# Altium schematic sheet Mini Multi Function Device.SchDoc
size A3; SheetNumber: 1; SheetTotal: 1
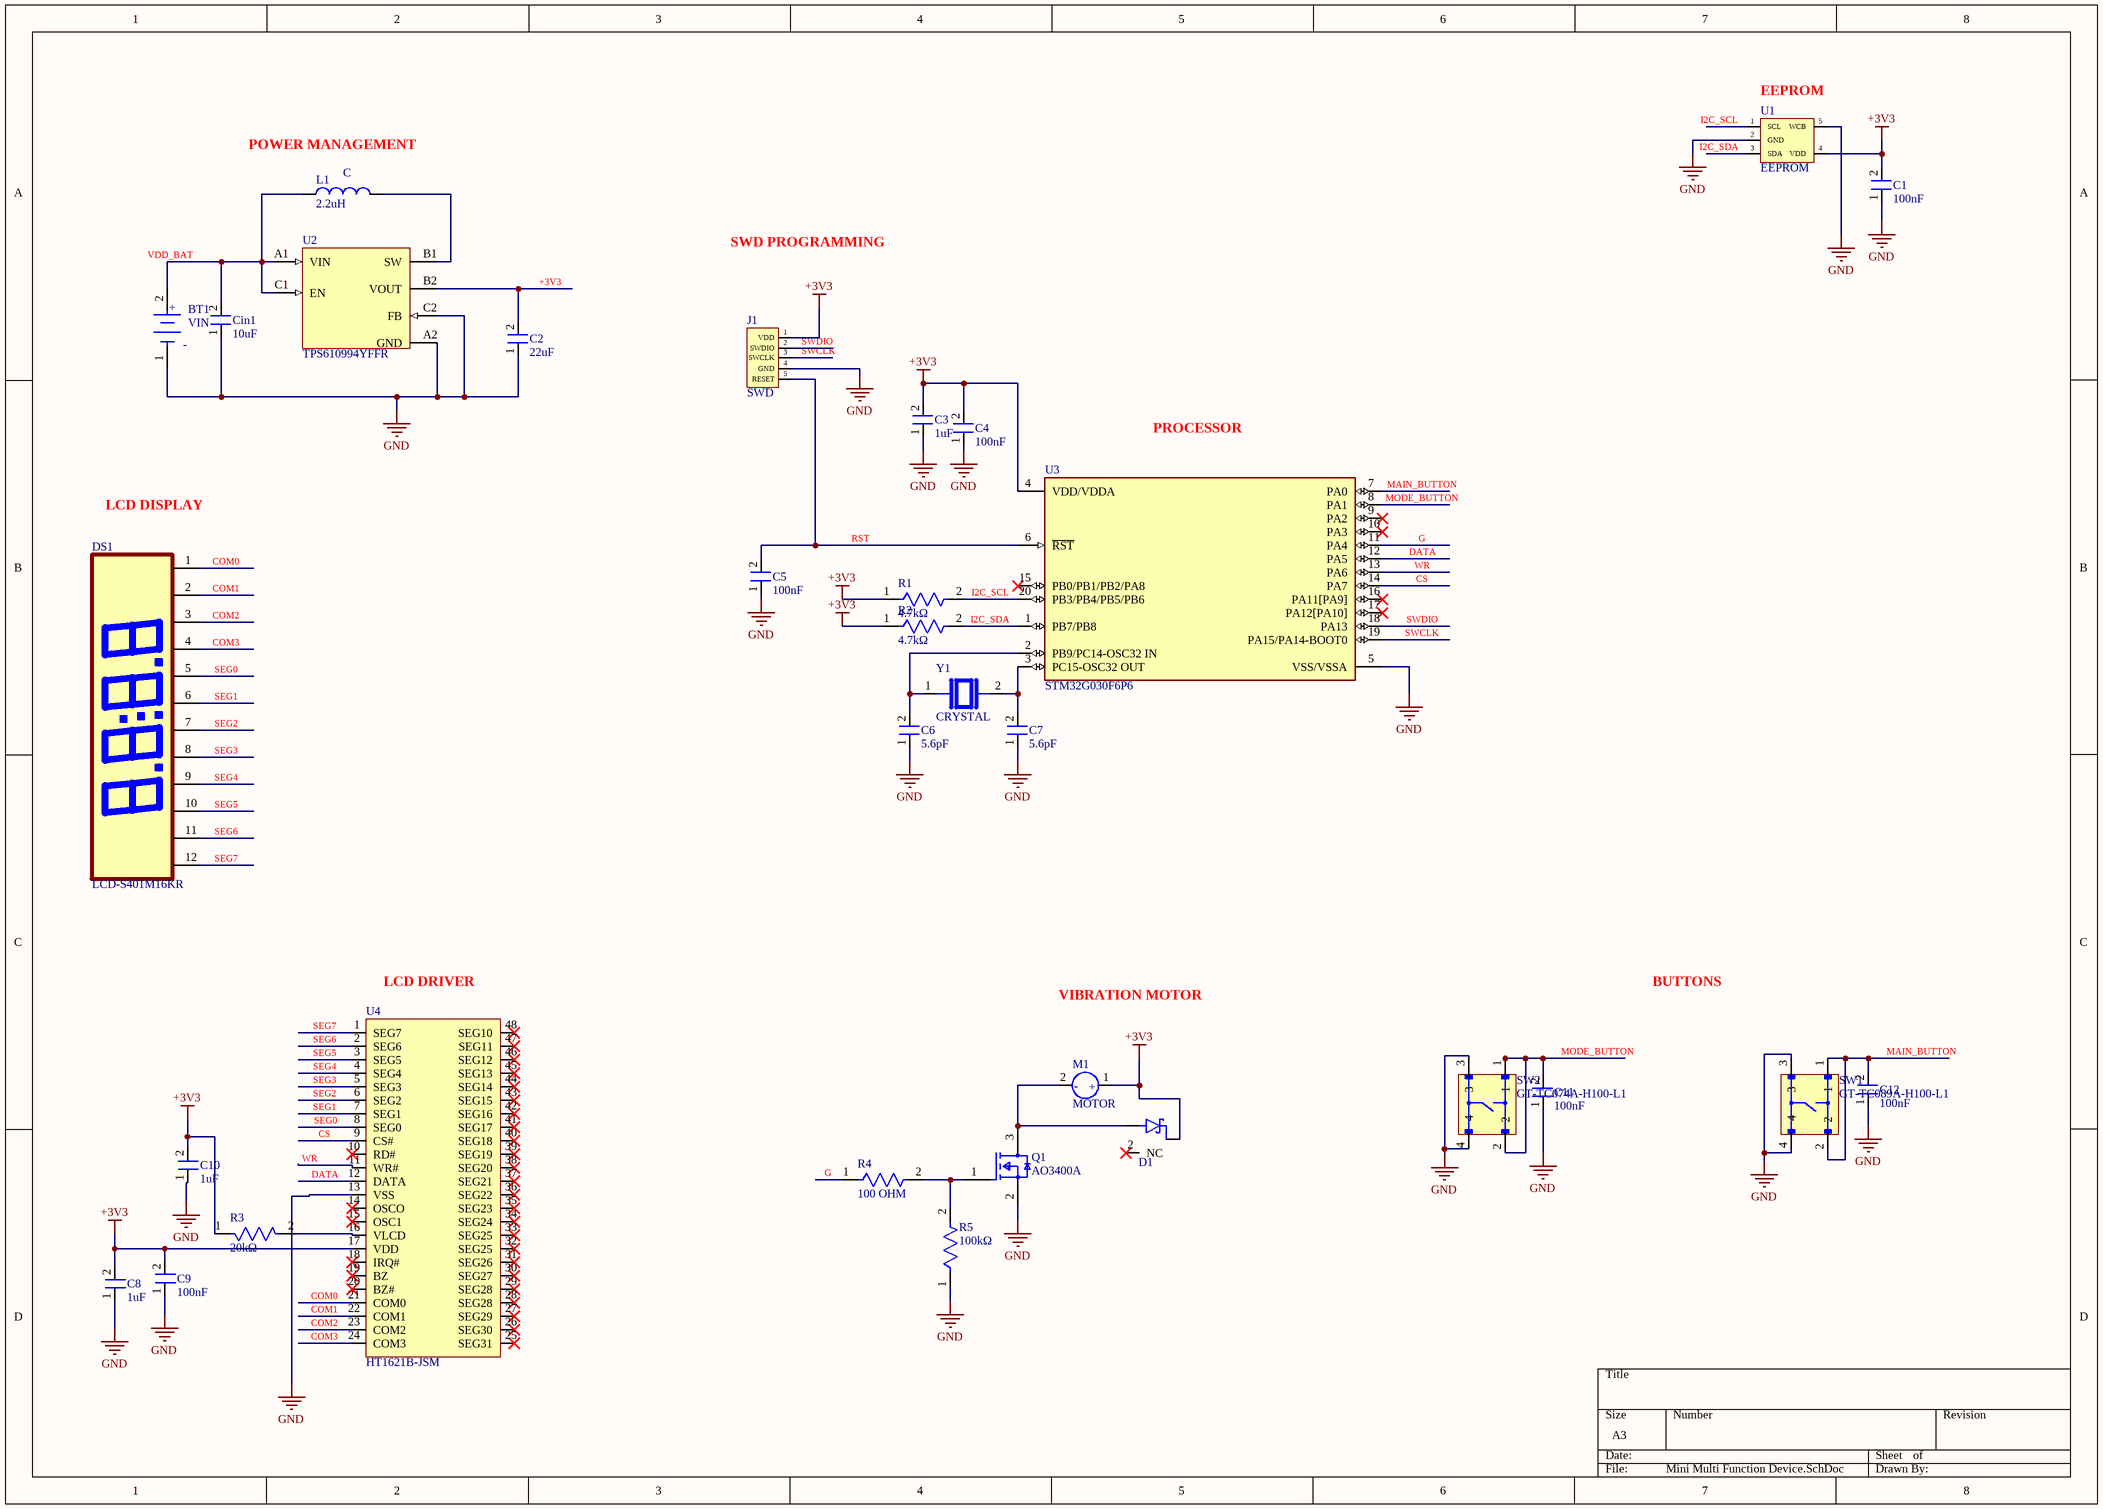
[diagram p0: Mini Multi Function Device.SchDoc]

## Parts
BT1  VIN  [FP-3034-MFG]
C1  100nF  [CAPACITOR]
C2  22uF  [CAPACITOR_0805]
C3  1uF  [CAPACITOR]
C4  100nF  [CAPACITOR]
C5  100nF  [CAPACITOR]
C6  5.6pF  [CAPACITOR]
C7  5.6pF  [CAPACITOR]
C8  1uF  [CAPACITOR]
C9  100nF  [CAPACITOR]
C10  1uF  [CAPACITOR]
C11  100nF  [CAPACITOR]
C12  100nF  [CAPACITOR]
Cin1  10uF  [CAPACITOR_0805]
D1  BAT54  [SOT95P240X120-3N]  (value not drawn)
DS1  LCD-S401M16KR  [LCD-S401M16KR]
J1  SWD  [SWD_HEADER]
L1  2.2uH  [INDC2520X100N]
M1  MOTOR  [VCLP1020B002L]
Q1  AO3400A  [FP-SOT23-MFG]
R1  4.7kΩ  [RESISTOR]
R2  4.7kΩ  [RESISTOR]
R3  20kΩ  [RESISTOR]
R4  100 OHM  [RESISTOR]
R5  100kΩ  [RESISTOR]
SW1  GT-TC089A-H100-L1  [SW-SMD_4P-L6.0-W6.0-P4.50-LS8.5]
SW2  GT-TC074A-H100-L1  [SW-SMD_4P-L4.5-W4.5-P3.00-LS7.5]
U1  EEPROM  [AT24C02C-STUM-TQN]
U2  TPS610994YFFR  [BGA6N40P3X2_122X88X62N]
U3  STM32G030F6P6  [FP-TSSOP20-YA-MFG]
U4  HT1621B-JSM  [HT1621B-JSM]
Y1  CRYSTAL  [OSC-SMD_L3.2-W1.5]

## Nets
+3V3: C1.2 C2.2 C3.2 C4.2 C8.2 C9.2 C10.2 D1.3 J1.1(VDD) M1.1 R1.1 R2.1 R3.1 U1.4(VDD) U2.B2(VOUT) U3.4(VDD/VDDA) U4.17(VDD)
GND: BT1.1(C) C1.1 C2.1 C3.1 C4.1 C5.1 C6.1 C7.1 C8.1 C9.1 C10.1 C11.1 C12.1 Cin1.1 J1.4(GND) Q1.2(S) R5.1 SW1.3 SW1.4 SW2.3 SW2.4 U1.2(GND) U1.5(WCB) U2.A2(GND) U2.C2(FB) U3.5(VSS/VSSA) U4.13(VSS)
COM0: DS1.1(P$1) U4.21(COM0)
COM1: DS1.2(P$2) U4.22(COM1)
COM2: DS1.3(P$3) U4.23(COM2)
COM3: DS1.4(P$4) U4.24(COM3)
CS: U3.14(PA7) U4.9(CS#)
DATA: U3.12(PA5) U4.12(DATA)
G: R4.1 U3.11(PA4)
I2C_SCL: R1.2 U1.1(SCL) U3.20(PB3/PB4/PB5/PB6)
I2C_SDA: R2.2 U1.3(SDA) U3.1(PB7/PB8)
MAIN_BUTTON: C12.2 SW1.1 SW1.2 U3.7(PA0)
MODE_BUTTON: C11.2 SW2.1 SW2.2 U3.8(PA1)
RST: C5.2 J1.5(RESET) U3.6(~{RST})
SEG0: DS1.5(P$5) U4.8(SEG0)
SEG1: DS1.6(P$6) U4.7(SEG1)
SEG2: DS1.7(P$7) U4.6(SEG2)
SEG3: DS1.8(P$8) U4.5(SEG3)
SEG4: DS1.9(P$9) U4.4(SEG4)
SEG5: DS1.10(P$10) U4.3(SEG5)
SEG6: DS1.11(P$11) U4.2(SEG6)
SEG7: DS1.12(P$12) U4.1(SEG7)
SWCLK: J1.3(SWCLK) U3.19(PA15/PA14-BOOT0)
SWDIO: J1.2(SWDIO) U3.18(PA13)
VDD_BAT: BT1.2(A) Cin1.2 L1.1 U2.A1(VIN) U2.C1(EN)
WR: U3.13(PA6) U4.11(WR#)
NetC6_2: C6.2 U3.2(PB9/PC14-OSC32_IN) Y1.1
NetC7_2: C7.2 U3.3(PC15-OSC32_OUT) Y1.2
NetD1_1: D1.1 M1.2 Q1.3(D)
NetL1_2: L1.2 U2.B1(SW)
NetQ1_1: Q1.1(G) R4.2 R5.2
NetR3_2: R3.2 U4.16(VLCD)

Not connected (* = marked no-connect by the designer): D1 2(NC)*; U3 9(PA2)* 10(PA3)* 15(PB0/PB1/PB2/PA8)* 16(PA11[PA9])* 17(PA12[PA10])*; U4 10(RD#)* 14(OSCO)* 15(OSC1)* 18(IRQ#)* 19(BZ)* 20(BZ#)* 25(SEG31)* 26(SEG30)* 27(SEG29)* 28(SEG28)* 29(SEG28)* 30(SEG27)* 31(SEG26)* 32(SEG25)* 33(SEG25)* 34(SEG24)* 35(SEG23)* 36(SEG22)* 37(SEG21)* 38(SEG20)* 39(SEG19)* 40(SEG18)* 41(SEG17)* 42(SEG16)* 43(SEG15)* 44(SEG14)* 45(SEG13)* 46(SEG12)* 47(SEG11)* 48(SEG10)*

## Notes on the sheet
- (near U1) EEPROM
- (near L1) POWER MANAGEMENT
- (near L1) C
- SWD PROGRAMMING
- PROCESSOR
- LCD DISPLAY
- (near U4) LCD DRIVER
- BUTTONS
- VIBRATION MOTOR
- (in symbol 3034) +; -
- (in symbol VCLP1020B002L) -; +

## Library data of the parts
BT1 = 3034: Retainer 1 Button cell Ø20.0mm 2020，2025，2032 PCBinstall，SMD mount 4.06mm(height); Manufacturer: Keystone; Number of Batteries: 1; Number of Contacts: 2; Supplier: DigiKey; Supplier Part Number: 36-3034-ND; Manufacturer Part Number: 3034; RoHS: Compliant; Category: Batteries and Accessories; Stock: 45307; Pricing: 1=0.52, 10=0.43, 25=0.3996, 100=0.3571, 500=0.31354, 1000=0.29647, 2500=0.2753, 5000=0.2603 (USD); Contact Material: Nickel; Contact Plating: Tin; Height: 4.31mm; Lead Free: Lead Free; Lifecycle Status: Production; Mounting Technology: PCB, Surface Mount; Number of Cells: 1; REACH SVHC: Unaffected; Termination: SMD/SMT; ComponentLink1URL: https://datasheet.octopart.com:443/3034-Keystone-datasheet-137334392.pdf?src-supplier=Upverter; ComponentLink1Description: https://datasheet.octopart.com:443/3034-Keystone-datasheet-137334392.pdf?src-supplier=Upverter; ComponentLink2URL: https://datasheet.octopart.com:443/3034-Keystone-datasheet-15715878.pdf?src-supplier=Keystone; ComponentLink2Description: https://datasheet.octopart.com:443/3034-Keystone-datasheet-15715878.pdf?src-supplier=Keystone; ComponentLink3URL: https://datasheet.octopart.com:443/3034-Keystone-datasheet-16749974.pdf?src-supplier=element14+APAC; ComponentLink3Description: https://datasheet.octopart.com:443/3034-Keystone-datasheet-16749974.pdf?src-supplier=element14+APAC; ComponentLink4URL: https://datasheet.octopart.com:443/3034-Keystone-datasheet-110726686.pdf?src-supplier=Farnell; ComponentLink4Description: https://datasheet.octopart.com:443/3034-Keystone-datasheet-110726686.pdf?src-supplier=Farnell; ComponentLink5URL: https://datasheet.octopart.com:443/3034-Keystone-datasheet-159768223.pdf?src-supplier=TME; ComponentLink5Description: https://datasheet.octopart.com:443/3034-Keystone-datasheet-159768223.pdf?src-supplier=TME; ComponentLink6URL: https://datasheet.octopart.com:443/3034-Keystone-datasheet-62113088.pdf?src-supplier=RS+(Formerly+Allied+Electronics); ComponentLink6Description: https://datasheet.octopart.com:443/3034-Keystone-datasheet-62113088.pdf?src-supplier=RS+(Formerly+Allied+Electronics); ComponentLink7URL: https://datasheet.octopart.com:443/3034-Keystone-datasheet-24992608.pdf?src-supplier=Future+Electronics; ComponentLink7Description: https://datasheet.octopart.com:443/3034-Keystone-datasheet-24992608.pdf?src-supplier=Future+Electronics; LCSC PART: C5199422
C1 C5 C9 = CC0402JRX5R6BB104: Ceramic Capacitor, Ceramic, 10V, 5% +Tol, 5% -Tol, X5R, 15% TC, 0.1uF, Surface Mount, 0402; Manufacturer: Yageo Group; Supplier: DigiKey; Supplier Part Number: 13-CC0402JRX5R6BB104CT-ND; Manufacturer Part Number: CC0402JRX5R6BB104; RoHS: Compliant; Category: Ceramic Capacitors; Stock: 348; Pricing: 1=0.1, 10=0.05, 50=0.034, 100=0.029, 500=0.02086 (USD); Value: 100nF; Case/Package: 0402; China RoHS: Compliant; Country of Origin: Mainland China, Taiwan; Depth: 500µm; Dielectric: X5R; Dielectric Material: Ceramic; Export Control Classification Number (ECCN) Code: EAR99; Halogen Free: Halogen Free; Height: 500µm; Harmonized Tariff Schedule (HTS) Code: 8532.24.00.20; Introduction Date: 2020-03-26; Lead Free: Lead Free; Length: 1mm; Lifecycle Status: Production; Max Operating Temperature: 85°C; Min Operating Temperature: -55°C; Mounting Technology: Surface Mount; Number of Terminals: 2; Packaging: Tape and Reel; REACH SVHC: Unaffected; Thickness: 558.8µm; Tolerance: 5%; Voltage Rating: 10V; Voltage Rating (DC): 10V; Width: 500µm; ComponentLink1URL: https://datasheet.octopart.com:443/CC0402JRX5R6BB104-Yageo-datasheet-145016144.pdf?src-supplier=IHS; ComponentLink1Description: https://datasheet.octopart.com:443/CC0402JRX5R6BB104-Yageo-datasheet-145016144.pdf?src-supplier=IHS; ComponentLink2URL: https://datasheet.octopart.com:443/CC0402JRX5R6BB104-Yageo-datasheet-149070021.pdf?src-supplier=TME; ComponentLink2Description: https://datasheet.octopart.com:443/CC0402JRX5R6BB104-Yageo-datasheet-149070021.pdf?src-supplier=TME; ComponentLink3URL: https://datasheet.octopart.com/CC0402JRX5R6BB104-Yageo-datasheet-86397281.pdf; ComponentLink3Description: https://datasheet.octopart.com/CC0402JRX5R6BB104-Yageo-datasheet-86397281.pdf; ComponentLink4URL: http://sigma.octopart.com:80/conflict_mineral_statement/Yageo-company-3.pdf?src-supplier=Compliance+Statements; ComponentLink4Description: http://sigma.octopart.com:80/conflict_mineral_statement/Yageo-company-3.pdf?src-supplier=Compliance+Statements; ComponentLink5URL: http://sigma.octopart.com:80/rohs_statement/Yageo-company-2.pdf?src-supplier=Compliance+Statements; ComponentLink5Description: http://sigma.octopart.com:80/rohs_statement/Yageo-company-2.pdf?src-supplier=Compliance+Statements; LCSC PART: C2185597
C2 = 0805X226M6R3CT: 22uF 6.3V X5R ±20% 0805 Multilayer Ceramic Capacitors MLCC - SMD/SMT ROHS; Manufacturer: Walsin Tech Corp; LCSC PART: C396739; Manufacturer Part Number: 0805X226M6R3CT
C3 C8 C10 = CL05A105KO5NNNC: 16V 1uF X5R 卤10% 0402 Multilayer Ceramic Capacitors MLCC - SMD/SMT ROHS; Manufacturer: Samsung Electro-Mechanics; Value: 1µF; Tolerance: 10%; Supplier: DigiKey; Supplier Part Number: 1276-1067-6-ND; Manufacturer Part Number: CL05A105KO5NNNC; RoHS: Compliant; Category: Ceramic Capacitors; Stock: 1053248; Pricing: 1=0.1, 10=0.043, 50=0.029, 100=0.0248, 500=0.01786 (USD); Case/Package: 0402; Case Code (Imperial): 0402; Case Code (Metric): 1005; China RoHS: Compliant; Contact Plating: Tin; Depth: 500µm; Dielectric: X5R; Dielectric Material: Ceramic; Height: 550µm; Length: 1mm; Lifecycle Status: Production; Material: Ceramic; Max Operating Temperature: 85°C; Min Operating Temperature: -55°C; Mounting Technology: Surface Mount; Number of Terminals: 2; Radiation Hardening: No; REACH SVHC: Unaffected; Schedule B: 8532240020, 8532240020|8532240020, 8532240020|8532240020|8532240020, 8532240020|8532240020|8532240020|8532240020; Thickness: 558.8µm; Voltage: 16V; Voltage Rating: 16V; Voltage Rating (DC): 16V; Width: 500µm; ComponentLink1URL: https://datasheet.octopart.com:443/CL05A105KO5NNNC-Samsung-Electro-Mechanics-datasheet-181960514.pdf?src-supplier=IHS; ComponentLink1Description: https://datasheet.octopart.com:443/CL05A105KO5NNNC-Samsung-Electro-Mechanics-datasheet-181960514.pdf?src-supplier=IHS; ComponentLink2URL: https://datasheet.octopart.com:443/CL05A105KO5NNNC-Samsung-Electro-Mechanics-datasheet-136031720.pdf?src-supplier=Samsung+SCT; ComponentLink2Description: https://datasheet.octopart.com:443/CL05A105KO5NNNC-Samsung-Electro-Mechanics-datasheet-136031720.pdf?src-supplier=Samsung+SCT; ComponentLink3URL: https://datasheet.octopart.com:443/CL05A105KO5NNNC-Samsung-Electro-Mechanics-datasheet-11776774.pdf?src-supplier=Future+Electronics; ComponentLink3Description: https://datasheet.octopart.com:443/CL05A105KO5NNNC-Samsung-Electro-Mechanics-datasheet-11776774.pdf?src-supplier=Future+Electronics; ComponentLink4URL: https://datasheet.octopart.com:443/CL05A105KO5NNNC-Samsung-Electro-Mechanics-datasheet-110226202.pdf?src-supplier=Future+Electronics; ComponentLink4Description: https://datasheet.octopart.com:443/CL05A105KO5NNNC-Samsung-Electro-Mechanics-datasheet-110226202.pdf?src-supplier=Future+Electronics; ComponentLink5URL: https://datasheet.octopart.com:443/CL05A105KO5NNNC-Samsung-Electro-Mechanics-datasheet-81461590.pdf?src-supplier=Future+Electronics; ComponentLink5Description: https://datasheet.octopart.com:443/CL05A105KO5NNNC-Samsung-Electro-Mechanics-datasheet-81461590.pdf?src-supplier=Future+Electronics; ComponentLink6URL: https://datasheet.octopart.com:443/CL05A105KO5NNNC-Samsung-datasheet-42280519.pdf?src-supplier=Future+Electronics; ComponentLink6Description: https://datasheet.octopart.com:443/CL05A105KO5NNNC-Samsung-datasheet-42280519.pdf?src-supplier=Future+Electronics; ComponentLink7URL: https://datasheet.octopart.com:443/CL05A105KO5NNNC-Samsung-datasheet-34152987.pdf?src-supplier=Future+Electronics; ComponentLink7Description: https://datasheet.octopart.com:443/CL05A105KO5NNNC-Samsung-datasheet-34152987.pdf?src-supplier=Future+Electronics; ComponentLink8URL: https://datasheet.octopart.com:443/CL05A105KO5NNNC-Samsung-datasheet-8329584.pdf?src-supplier=Future+Electronics; ComponentLink8Description: https://datasheet.octopart.com:443/CL05A105KO5NNNC-Samsung-datasheet-8329584.pdf?src-supplier=Future+Electronics; ComponentLink9URL: https://datasheet.octopart.com:443/CL05A105KO5NNNC-Samsung-Electro-Mechanics-datasheet-149136633.pdf?src-supplier=Future+Electronics; ComponentLink9Description: https://datasheet.octopart.com:443/CL05A105KO5NNNC-Samsung-Electro-Mechanics-datasheet-149136633.pdf?src-supplier=Future+Electronics; ComponentLink10URL: https://datasheet.octopart.com/CL05A105KO5NNNC-Samsung-Electro-Mechanics-datasheet-97040617.pdf; ComponentLink10Description: https://datasheet.octopart.com/CL05A105KO5NNNC-Samsung-Electro-Mechanics-datasheet-97040617.pdf; ComponentLink11URL: https://datasheet.octopart.com/CL05A105KO5NNNC-Samsung-Electro-Mechanics-datasheet-8324245.pdf; ComponentLink11Description: https://datasheet.octopart.com/CL05A105KO5NNNC-Samsung-Electro-Mechanics-datasheet-8324245.pdf; ComponentLink12URL: https://datasheet.octopart.com:443/CL05A105KO5NNNC-Samsung-datasheet-59220082.pdf?src-supplier=TME; ComponentLink12Description: https://datasheet.octopart.com:443/CL05A105KO5NNNC-Samsung-datasheet-59220082.pdf?src-supplier=TME; LCSC PART: C29266
C4 C11 C12 = FCC0402B104K160AT: FCC0402B104K160AT 100nF ±10% 16V Ceramic Capacitor X7R 0402 Ceramic Capacitors  100nF   16V 10%; Manufacturer: FOJAN; LCSC PART: C5137468; Manufacturer Part Number: FCC0402B104K160AT
C6 C7 = 0402CG5R6C100NT: 10V 5.6pF C0G 0402 Multilayer Ceramic Capacitors MLCC - SMD/SMT ROHS; Manufacturer: FH (Guangdong Fenghua Advanced Tech); LCSC PART: C285041; Manufacturer Part Number: 0402CG5R6C100NT
Cin1 = GRM21BR61A106KE19L: 10V 10uF X5R ±10% 0805 Multilayer Ceramic Capacitors MLCC - SMD/SMT ROHS; Manufacturer: Murata Electronics; LCSC PART: C77073; Manufacturer Part Number: GRM21BR61A106KE19L
D1 = BAT54: Diode Schottky 30V 0.2A Automotive 3-Pin SOT-23; Manufacturer: Diodes Inc.; Value: 10pF; Current Rating: 200mA; Element Configuration: Single; Forward Voltage: 240mV; Max Forward Surge Current (Ifsm): 600mA; Max Power Dissipation: 200mW; Max Reverse Leakage Current: 2µA; Number of Elements: 1; Polarity: Standard; Reverse Recovery Time: 5ns; Reverse Standoff Voltage: 25V; Supplier: Newark; Supplier Part Number: BAT54; Manufacturer Part Number: BAT54; RoHS: Compliant; Category: Schottky Diodes; Stock: 48918; Pricing: 1=0.222, 50=0.174, 100=0.11, 250=0.091, 500=0.079, 1000=0.065, 2500=0.053, 5000=0.051 (USD); Case/Package: SOT-23; China RoHS: Non-Compliant; Country of Origin: Mainland China; Export Control Classification Number (ECCN) Code: EAR99; Forward Current: 200mA; Harmonized Tariff Schedule (HTS) Code: 8541.10.00.70; Introduction Date: 1995-09-01; Lead Free: Lead Free; Lifecycle Status: Production; LTB Date: 2021-08-06; LTD Date: 2021-08-06; Max Operating Temperature: 125°C; Max Output current: 200mA; Max Repetitive Reverse Voltage (Vrrm): 30V; Min Breakdown Voltage: 30V; Min Operating Temperature: -65°C; Pins: 3; Number of Terminals: 3; Output Current: 200mA; Packaging: Cut Tape; Peak Reverse Current: 2µA; Power Dissipation: 200mW; Power Rating: 200mW; REACH SVHC: Affected; Termination: SMD/SMT; Voltage Rating (DC): 30V; Width: 3.05mm; ComponentLink1URL: https://datasheet.octopart.com:443/BAT54-Rectron-datasheet-181184833.pdf?src-supplier=IHS; ComponentLink1Description: https://datasheet.octopart.com:443/BAT54-Rectron-datasheet-181184833.pdf?src-supplier=IHS; ComponentLink2URL: https://datasheet.octopart.com:443/BAT54-Lite-On-datasheet-149134416.pdf?src-supplier=IHS; ComponentLink2Description: https://datasheet.octopart.com:443/BAT54-Lite-On-datasheet-149134416.pdf?src-supplier=IHS; ComponentLink3URL: https://datasheet.octopart.com:443/BAT54-Rectron-datasheet-182306116.pdf?src-supplier=IHS; ComponentLink3Description: https://datasheet.octopart.com:443/BAT54-Rectron-datasheet-182306116.pdf?src-supplier=IHS; ComponentLink4URL: https://datasheet.octopart.com:443/BAT54-Diodes-Inc.-datasheet-181528020.pdf?src-supplier=IHS; ComponentLink4Description: https://datasheet.octopart.com:443/BAT54-Diodes-Inc.-datasheet-181528020.pdf?src-supplier=IHS; ComponentLink5URL: https://datasheet.octopart.com:443/BAT54-Diodes-Inc.-datasheet-180551406.pdf?src-supplier=IHS; ComponentLink5Description: https://datasheet.octopart.com:443/BAT54-Diodes-Inc.-datasheet-180551406.pdf?src-supplier=IHS; ComponentLink6URL: https://datasheet.octopart.com:443/BAT54-Diodes-Inc.-datasheet-181528181.pdf?src-supplier=IHS; ComponentLink6Description: https://datasheet.octopart.com:443/BAT54-Diodes-Inc.-datasheet-181528181.pdf?src-supplier=IHS; ComponentLink7URL: https://datasheet.octopart.com:443/BAT54-Diodes-Inc.-datasheet-180087920.pdf?src-supplier=IHS; ComponentLink7Description: https://datasheet.octopart.com:443/BAT54-Diodes-Inc.-datasheet-180087920.pdf?src-supplier=IHS; ComponentLink8URL: https://datasheet.octopart.com:443/BAT54-Diodes-Inc.-datasheet-180663379.pdf?src-supplier=IHS; ComponentLink8Description: https://datasheet.octopart.com:443/BAT54-Diodes-Inc.-datasheet-180663379.pdf?src-supplier=IHS; ComponentLink9URL: https://datasheet.octopart.com:443/BAT54-Zetex-datasheet-9882.pdf?src-supplier=IHS; ComponentLink9Description: https://datasheet.octopart.com:443/BAT54-Zetex-datasheet-9882.pdf?src-supplier=IHS; ComponentLink10URL: https://datasheet.octopart.com:443/BAT54-Diodes-Inc.-datasheet-180493470.pdf?src-supplier=IHS; ComponentLink10Description: https://datasheet.octopart.com:443/BAT54-Diodes-Inc.-datasheet-180493470.pdf?src-supplier=IHS; ComponentLink11URL: https://datasheet.octopart.com:443/BAT54-Diodes-Inc.-datasheet-182327183.pdf?src-supplier=IHS; ComponentLink11Description: https://datasheet.octopart.com:443/BAT54-Diodes-Inc.-datasheet-182327183.pdf?src-supplier=IHS; ComponentLink12URL: https://datasheet.octopart.com:443/BAT54-Diodes-Inc.-datasheet-548743.pdf?src-supplier=element14; ComponentLink12Description: https://datasheet.octopart.com:443/BAT54-Diodes-Inc.-datasheet-548743.pdf?src-supplier=element14; ComponentLink13URL: https://datasheet.octopart.com:443/BAT54-Diodes-Inc.-datasheet-41192442.pdf?src-supplier=Newark; ComponentLink13Description: https://datasheet.octopart.com:443/BAT54-Diodes-Inc.-datasheet-41192442.pdf?src-supplier=Newark; ComponentLink14URL: https://datasheet.octopart.com:443/BAT54-Diodes-Inc.-datasheet-134530442.pdf?src-supplier=Diodes+Inc+SCT; ComponentLink14Description: https://datasheet.octopart.com:443/BAT54-Diodes-Inc.-datasheet-134530442.pdf?src-supplier=Diodes+Inc+SCT; ComponentLink15URL: https://sigma.octopart.com:443/138706058/technical_drawing/Diodes-Inc.-BAT54.pdf?src-supplier=Diodes+Inc+SCT; ComponentLink15Description: https://sigma.octopart.com:443/138706058/technical_drawing/Diodes-Inc.-BAT54.pdf?src-supplier=Diodes+Inc+SCT; ComponentLink16URL: https://datasheet.octopart.com/BAT54-Diodes-Inc.-datasheet-11970926.pdf; ComponentLink16Description: https://datasheet.octopart.com/BAT54-Diodes-Inc.-datasheet-11970926.pdf; ComponentLink17URL: https://datasheet.octopart.com/BAT54-Diodes-Inc.-datasheet-10029091.pdf; ComponentLink17Description: https://datasheet.octopart.com/BAT54-Diodes-Inc.-datasheet-10029091.pdf; ComponentLink18URL: https://datasheet.octopart.com/BAT54-Diodes-Inc.-datasheet-5320128.pdf; ComponentLink18Description: https://datasheet.octopart.com/BAT54-Diodes-Inc.-datasheet-5320128.pdf; ComponentLink19URL: http://sigma.octopart.com:80/15540767/rohs_certificate/Diodes-Inc.-BAT54.pdf?src-supplier=Compliance+Statements; ComponentLink19Description: http://sigma.octopart.com:80/15540767/rohs_certificate/Diodes-Inc.-BAT54.pdf?src-supplier=Compliance+Statements; ComponentLink20URL: http://sigma.octopart.com:80/15616893/materials_sheet/Diodes-Inc.-BAT54.pdf?src-supplier=Compliance+Statements; ComponentLink20Description: http://sigma.octopart.com:80/15616893/materials_sheet/Diodes-Inc.-BAT54.pdf?src-supplier=Compliance+Statements; LCSC PART: C7528904
DS1 = LCD-S401M16KR: LCD Numeric Display Modules 4 Digit 0.17 7 Seg Reflective; Manufacturer: Lumex; Background Color: Grey; Nominal Supply Voltage (DC): 3V; Number of Circuits: 5; Supplier: DigiKey; Supplier Part Number: LCD-S401M16KR-ND; Manufacturer Part Number: LCD-S401M16KR; RoHS: Compliant; Category: LCD, OLED, Graphic Displays; Stock: 6110; Pricing: 1=2.07, 10=1.484, 100=1.1317, 864=0.93564, 1728=0.89114, 2592=0.86835, 5184=0.83419, 10368=0.80529 (USD); China RoHS: Compliant; Lifecycle Status: Production; Max Operating Temperature: 50°C; Min Operating Temperature: 0°C; Operating Supply Voltage: 3V; Packaging: Bulk; REACH SVHC: Yes; Schedule B: 8531200020, 8531200040, 8531200040|8531200040, 8531200040|8531200040|8531200040; ComponentLink1URL: https://datasheet.octopart.com:443/LCD-S401M16KR-Lumex-datasheet-154837219.pdf?src-supplier=JRH+Electronics; ComponentLink1Description: https://datasheet.octopart.com:443/LCD-S401M16KR-Lumex-datasheet-154837219.pdf?src-supplier=JRH+Electronics; ComponentLink2URL: https://datasheet.octopart.com:443/LCD-S401M16KR-Lumex-datasheet-155954798.pdf?src-supplier=Future+Electronics; ComponentLink2Description: https://datasheet.octopart.com:443/LCD-S401M16KR-Lumex-datasheet-155954798.pdf?src-supplier=Future+Electronics; LCSC PART: C17355221
J1 = SWD_HEADER
L1 = LQM2HPN2R2MG0L: Inductor Power Chip Shielded Multi-Layer 2.2uH 20% 1MHz Ferrite 1.3A 0.1Ohm DCR 1008 T/R; Manufacturer: Murata; Manufacturer Lifecycle Status: IN PRODUCTION; Value: 220µF; DC Resistance (DCR): 100mΩ; Number of Circuits: 1; Self Resonant Frequency: 40MHz; Voltage Rating: 50V; Supplier: DigiKey; Supplier Part Number: 490-5114-1-ND; Manufacturer Part Number: LQM2HPN2R2MG0L; RoHS: Compliant; Category: Fixed Inductors; Stock: 505234; Pricing: 1=0.17, 10=0.142, 100=0.1167, 1000=0.09599 (USD); Case/Package: 1008; Case Code (Imperial): 1008; Case Code (Metric): 2520; Core Material: Ferrite; Current Rating: 1.3A; DC Current: 1.3A; Depth: 2.2mm; Diameter: 10mm; Height: 900µm; Height - Seated (Max): 990.6µm; Inductance Tolerance: 20%; Lead Free: Lead Free; Lead Pitch: 5mm; Length: 2.5mm; Lifecycle Status: Production; Max Current Rating: 1.3A; Max DC Current: 1.3A; Max Operating Temperature: 125°C; Military Standard: Not; Min Operating Temperature: -55°C; Mounting Technology: Through Hole; Pins: 2; Number of Terminals: 2; Packaging: Bulk; Radiation Hardening: No; REACH SVHC: Unaffected; RMS Current (Irms): 1.3A; Schedule B: 8504500000, 8504500000|8504500000, 8504500000|8504500000|8504500000, 8504500000|8504500000|8504500000|8504500000; ESR: 100mΩ; Shielding: Shielded; Termination: SMD/SMT; Test Frequency: 1MHz; Tolerance: 20%; Voltage Rating (DC): 50V; Width: 2mm; ComponentLink1URL: https://datasheet.octopart.com:443/LQM2HPN2R2MG0L-Murata-datasheet-11799310.pdf?src-supplier=Upverter; ComponentLink1Description: https://datasheet.octopart.com:443/LQM2HPN2R2MG0L-Murata-datasheet-11799310.pdf?src-supplier=Upverter; ComponentLink2URL: https://datasheet.octopart.com:443/LQM2HPN2R2MG0L-Murata-datasheet-44660790.pdf?src-supplier=Upverter; ComponentLink2Description: https://datasheet.octopart.com:443/LQM2HPN2R2MG0L-Murata-datasheet-44660790.pdf?src-supplier=Upverter; ComponentLink3URL: https://datasheet.octopart.com:443/LQM2HPN2R2MG0L-Murata-datasheet-39128533.pdf?src-supplier=Newark; ComponentLink3Description: https://datasheet.octopart.com:443/LQM2HPN2R2MG0L-Murata-datasheet-39128533.pdf?src-supplier=Newark; ComponentLink4URL: https://datasheet.octopart.com:443/LQM2HPN2R2MG0L-Murata-datasheet-141288001.pdf?src-supplier=Ciiva; ComponentLink4Description: https://datasheet.octopart.com:443/LQM2HPN2R2MG0L-Murata-datasheet-141288001.pdf?src-supplier=Ciiva; ComponentLink5URL: https://datasheet.octopart.com:443/LQM2HPN2R2MG0L-Murata-datasheet-140714418.pdf?src-supplier=Ciiva; ComponentLink5Description: https://datasheet.octopart.com:443/LQM2HPN2R2MG0L-Murata-datasheet-140714418.pdf?src-supplier=Ciiva; ComponentLink6URL: https://datasheet.octopart.com:443/LQM2HPN2R2MG0L-Murata-datasheet-138755521.pdf?src-supplier=Ciiva; ComponentLink6Description: https://datasheet.octopart.com:443/LQM2HPN2R2MG0L-Murata-datasheet-138755521.pdf?src-supplier=Ciiva; ComponentLink7URL: https://datasheet.octopart.com:443/LQM2HPN2R2MG0L-Murata-datasheet-140710322.pdf?src-supplier=TME; ComponentLink7Description: https://datasheet.octopart.com:443/LQM2HPN2R2MG0L-Murata-datasheet-140710322.pdf?src-supplier=TME; ComponentLink8URL: https://datasheet.octopart.com:443/LQM2HPN2R2MG0L-Murata-datasheet-142045970.pdf?src-supplier=Arrow.cn; ComponentLink8Description: https://datasheet.octopart.com:443/LQM2HPN2R2MG0L-Murata-datasheet-142045970.pdf?src-supplier=Arrow.cn; ComponentLink9URL: https://datasheet.octopart.com:443/LQM2HPN2R2MG0L-Murata-datasheet-145450753.pdf?src-supplier=Geoflip; ComponentLink9Description: https://datasheet.octopart.com:443/LQM2HPN2R2MG0L-Murata-datasheet-145450753.pdf?src-supplier=Geoflip; ComponentLink10URL: https://datasheet.octopart.com:443/LQM2HPN2R2MG0L-Murata-datasheet-104455174.pdf?src-supplier=Future+Electronics; ComponentLink10Description: https://datasheet.octopart.com:443/LQM2HPN2R2MG0L-Murata-datasheet-104455174.pdf?src-supplier=Future+Electronics; ComponentLink11URL: https://datasheet.octopart.com/LQM2HPN2R2MG0L-Murata-datasheet-14392801.pdf; ComponentLink11Description: https://datasheet.octopart.com/LQM2HPN2R2MG0L-Murata-datasheet-14392801.pdf; ComponentLink12URL: http://sigma.octopart.com:80/reach_statement/Murata-company-16.pdf?src-supplier=Compliance+Statements; ComponentLink12Description: http://sigma.octopart.com:80/reach_statement/Murata-company-16.pdf?src-supplier=Compliance+Statements; LCSC PART: C86092
M1 = VCLP1020B002L: Vibration Coin 3V Low Curr 0.75G; Manufacturer: Vybronics; Supplier: DigiKey; Supplier Part Number: 1670-VCLP1020B002L-ND; Manufacturer Part Number: VCLP1020B002L; Category: AC, DC and Servo Motors; Stock: 4086; Pricing: 1=3.15, 5=2.892, 10=2.789, 25=2.658, 50=2.5628, 100=2.4713, 250=2.35528, 500=2.27116, 1000=2.19002 (USD); LCSC PART: C17192037
Q1 = AO3400A: Trans MOSFET N-CH 30V 5.7A 3-Pin SOT-23; Manufacturer: Alpha & Omega Semiconductor; Drain to Source Resistance: 26.5mΩ; Gate to Source Voltage (Vgs): 12V; Input Capacitance: 630pF; Max Junction Temperature (Tj): 150°C; Max Power Dissipation: 1.4W; Number of Channels: 1; Threshold Voltage: 650mV; Turn-Off Delay Time: 25ns; Turn-On Delay Time: 3ns; Supplier: DigiKey; Supplier Part Number: 785-1000-6-ND; Manufacturer Part Number: AO3400A; RoHS: Compliant; Category: MOSFETs; Stock: 64557; Pricing: 1=0.52, 10=0.322, 50=0.2332, 100=0.2043, 500=0.15316 (USD); Case/Package: SOT-23; Continuous Drain Current (ID): 5.7A; Country of Origin: Mainland China; Drain to Source Breakdown Voltage: 30V; Drain to Source Voltage (Vdss): 30V; Export Control Classification Number (ECCN) Code: EAR99; Height: 1.25mm; Introduction Date: 2007-04-17; Lead Free: Lead Free; Lifecycle Status: Production; Max Operating Temperature: 150°C; Min Breakdown Voltage: 30V; Min Operating Temperature: -55°C; Mounting Technology: Surface Mount; Number of Elements: 1; Pins: 3; Number of Terminals: 3; Power Dissipation: 1.4W; Radiation Hardening: No; Rds On Max: 26.5mΩ; REACH SVHC: Unaffected; Schedule B: 8541290080, 8541290080|8541290080|8541290080|8541290080|8541290080; ComponentLink1URL: https://sigma.octopart.com:443/140150677/technical_drawing/Alpha-%26-Omega-Semiconductor-AO3400A.pdf?src-supplier=Alpha+%26+Omega+Semiconductor+SCT; ComponentLink1Description: https://sigma.octopart.com:443/140150677/technical_drawing/Alpha-%26-Omega-Semiconductor-AO3400A.pdf?src-supplier=Alpha+%26+Omega+Semiconductor+SCT; ComponentLink2URL: https://datasheet.octopart.com:443/AO3400A-Alpha-%26-Omega-Semiconductor-datasheet-11777925.pdf?src-supplier=IHS; ComponentLink2Description: https://datasheet.octopart.com:443/AO3400A-Alpha-%26-Omega-Semiconductor-datasheet-11777925.pdf?src-supplier=IHS; ComponentLink3URL: https://sigma.octopart.com:443/138895710/technical_drawing/Alpha-%26-Omega-Semiconductor-AO3400A.pdf?src-supplier=Upverter; ComponentLink3Description: https://sigma.octopart.com:443/138895710/technical_drawing/Alpha-%26-Omega-Semiconductor-AO3400A.pdf?src-supplier=Upverter; ComponentLink4URL: https://datasheet.octopart.com:443/AO3400A-Alpha-%26-Omega-Semiconductor-datasheet-14060799.pdf?src-supplier=iiiC; ComponentLink4Description: https://datasheet.octopart.com:443/AO3400A-Alpha-%26-Omega-Semiconductor-datasheet-14060799.pdf?src-supplier=iiiC; ComponentLink5URL: https://datasheet.octopart.com:443/AO3400A-Alpha-%26-Omega-Semiconductor-datasheet-5402508.pdf?src-supplier=Verical; ComponentLink5Description: https://datasheet.octopart.com:443/AO3400A-Alpha-%26-Omega-Semiconductor-datasheet-5402508.pdf?src-supplier=Verical; LCSC PART: C20917
R1 R2 = CRF0402R472JN: -55℃~+125℃ 30V 4.7kΩ 62.5mW ±5% ±50ppm/℃ 0402 Chip Resistor - Surface Mount ROHS; Manufacturer: SIE; LCSC PART: C54974059; Manufacturer Part Number: CRF0402R472JN
R3 = AR02DTD2002: -55℃~+155℃ 20kΩ 25V 62.5mW Thin Film Resistor ±0.5% ±50ppm/℃ 0402 Chip Resistor - Surface Mount ROHS; Manufacturer: Viking Tech; LCSC PART: C319759; Manufacturer Part Number: AR02DTD2002
R4 = AC0402JR-07100RL: Res Thick Film 0402 100 Ohm 5% 0.063W(1/16W) ±100ppm/C Pad SMD T/R Automotive AEC-Q200; Manufacturer: Yageo Group; Max Power Dissipation: 63mW; Power Rating: 62.5mW; Value: 100Ω; Temperature Coefficient: 100ppm/°C; Voltage Rating: 50V; Supplier: DigiKey; Supplier Part Number: YAG3516CT-ND; Manufacturer Part Number: AC0402JR-07100RL; RoHS: Compliant; Category: Chip SMD Resistors; Stock: 671269; Pricing: 1=0.1, 10=0.022, 25=0.0164, 50=0.013, 100=0.0105, 250=0.00804, 500=0.00666, 1000=0.00558, 5000=0.0039 (USD); Case/Package: 0402; Case Code (Imperial): 0402; Case Code (Metric): 1005; China RoHS: Non-Compliant; Composition: Thick Film; Country of Origin: Mainland China, Taiwan; Depth: 500µm; Export Control Classification Number (ECCN) Code: EAR99; Features: Automotive AEC-Q200, Moisture Resistant; Height: 320µm; Harmonized Tariff Schedule (HTS) Code: 8533.21.00.30; Introduction Date: 2012-04-10; Length: 1mm; Lifecycle Status: Production; Max Operating Temperature: 155°C; Military Standard: Not; Min Operating Temperature: -55°C; Mounting Technology: Surface Mount; Number of Terminals: 2; Number of Terminations: 2; Packaging: Tape & Reel; Ratings: AEC-Q200; REACH SVHC: Unaffected; Schedule B: 8533210045, 8533210045|8533210045, 8533210045|8533210045|8533210045, 8533210045|8533210045|8533210045|8533210045; Termination: SMD/SMT; Tolerance: 5%; Weight: 652.039032µg; Width: 500µm; Working Voltage: 50V; ComponentLink1URL: https://datasheet.octopart.com:443/AC0402JR-07100RL-Yageo-datasheet-182189377.pdf?src-supplier=IHS; ComponentLink1Description: https://datasheet.octopart.com:443/AC0402JR-07100RL-Yageo-datasheet-182189377.pdf?src-supplier=IHS; ComponentLink2URL: https://datasheet.octopart.com:443/AC0402JR-07100RL-Yageo-datasheet-83209224.pdf?src-supplier=Upverter; ComponentLink2Description: https://datasheet.octopart.com:443/AC0402JR-07100RL-Yageo-datasheet-83209224.pdf?src-supplier=Upverter; ComponentLink3URL: https://datasheet.octopart.com:443/AC0402JR-07100RL-Yageo-datasheet-178509465.pdf?src-supplier=Newark; ComponentLink3Description: https://datasheet.octopart.com:443/AC0402JR-07100RL-Yageo-datasheet-178509465.pdf?src-supplier=Newark; ComponentLink4URL: https://datasheet.octopart.com:443/AC0402JR-07100RL-Yageo-Group-datasheet-188689268.pdf?src-supplier=LCSC; ComponentLink4Description: https://datasheet.octopart.com:443/AC0402JR-07100RL-Yageo-Group-datasheet-188689268.pdf?src-supplier=LCSC; ComponentLink5URL: https://datasheet.octopart.com:443/AC0402JR-07100RL-Yageo-datasheet-151884373.pdf?src-supplier=Future+Electronics; ComponentLink5Description: https://datasheet.octopart.com:443/AC0402JR-07100RL-Yageo-datasheet-151884373.pdf?src-supplier=Future+Electronics; ComponentLink6URL: https://datasheet.octopart.com:443/AC0402JR-07100RL-Yageo-Group-datasheet-189830439.pdf?src-supplier=Future+Electronics; ComponentLink6Description: https://datasheet.octopart.com:443/AC0402JR-07100RL-Yageo-Group-datasheet-189830439.pdf?src-supplier=Future+Electronics; ComponentLink7URL: https://datasheet.octopart.com:443/AC0402JR-07100RL-Yageo-datasheet-166720450.pdf?src-supplier=Future+Electronics; ComponentLink7Description: https://datasheet.octopart.com:443/AC0402JR-07100RL-Yageo-datasheet-166720450.pdf?src-supplier=Future+Electronics; ComponentLink8URL: https://datasheet.octopart.com:443/AC0402JR-07100RL-Yageo-datasheet-137699919.pdf?src-supplier=Future+Electronics; ComponentLink8Description: https://datasheet.octopart.com:443/AC0402JR-07100RL-Yageo-datasheet-137699919.pdf?src-supplier=Future+Electronics; ComponentLink9URL: https://datasheet.octopart.com:443/AC0402JR-07100RL-Yageo-datasheet-62139191.pdf?src-supplier=Future+Electronics; ComponentLink9Description: https://datasheet.octopart.com:443/AC0402JR-07100RL-Yageo-datasheet-62139191.pdf?src-supplier=Future+Electronics; ComponentLink10URL: https://datasheet.octopart.com:443/AC0402JR-07100RL-Yageo-datasheet-58829331.pdf?src-supplier=Future+Electronics; ComponentLink10Description: https://datasheet.octopart.com:443/AC0402JR-07100RL-Yageo-datasheet-58829331.pdf?src-supplier=Future+Electronics; ComponentLink11URL: https://datasheet.octopart.com:443/AC0402JR-07100RL-Yageo-datasheet-128678457.pdf?src-supplier=X-ON; ComponentLink11Description: https://datasheet.octopart.com:443/AC0402JR-07100RL-Yageo-datasheet-128678457.pdf?src-supplier=X-ON; ComponentLink12URL: https://datasheet.octopart.com/AC0402JR-07100RL-Yageo-datasheet-12512238.pdf; ComponentLink12Description: https://datasheet.octopart.com/AC0402JR-07100RL-Yageo-datasheet-12512238.pdf; ComponentLink13URL: http://sigma.octopart.com:80/conflict_mineral_statement/Yageo-company-3.pdf?src-supplier=Compliance+Statements; ComponentLink13Description: http://sigma.octopart.com:80/conflict_mineral_statement/Yageo-company-3.pdf?src-supplier=Compliance+Statements; ComponentLink14URL: http://sigma.octopart.com:80/rohs_statement/Yageo-company-2.pdf?src-supplier=Compliance+Statements; ComponentLink14Description: http://sigma.octopart.com:80/rohs_statement/Yageo-company-2.pdf?src-supplier=Compliance+Statements; LCSC PART: C138288
R5 = RC0402JR-07100KL: 62.5mW Thick Film Resistors 50V ±100ppm/℃ ±5% 100kΩ 0402 Chip Resistor - Surface Mount ROHS; Manufacturer: Yageo Group; Max Power Dissipation: 63mW; Temperature Coefficient: 100ppm/°C; Supplier: DigiKey; Supplier Part Number: 311-100KJRCT-ND; Manufacturer Part Number: RC0402JR-07100KL; RoHS: Compliant; Category: Chip SMD Resistors; Stock: 495681; Pricing: 1=0.1, 10=0.019, 25=0.0136, 50=0.0108, 100=0.0087, 250=0.0066, 500=0.00542, 1000=0.00451, 5000=0.00309 (USD); Case/Package: 0402; Case Code (Imperial): 0402; China RoHS: Non-Compliant; Composition: Thick Film; Country of Origin: Mainland China, Taiwan; Depth: 500µm; Export Control Classification Number (ECCN) Code: EAR99; Features: Moisture Resistant; Height: 350µm; Harmonized Tariff Schedule (HTS) Code: 8533.21.00.30; Introduction Date: 2004-10-04; Lead Free: Lead Free; Length: 1mm; Lifecycle Status: Production; Max Operating Temperature: 155°C; Military Standard: Not; Min Operating Temperature: -55°C; Mounting Technology: Surface Mount; Pins: 2; Number of Terminals: 2; Number of Terminations: 2; Packaging: Tape & Reel; Power Rating: 62.5mW; REACH SVHC: Unaffected; Value: 100kΩ; Schedule B: 8533210045, 8533210045|8533210045, 8533210045|8533210045|8533210045, 8533210045|8533210045|8533210045|8533210045; Termination: SMD/SMT; Tolerance: 5%; Voltage Rating: 50V; Voltage Rating (AC): 50V; Voltage Rating (DC): 50V; Width: 500µm; Working Voltage: 50V; ComponentLink1URL: https://datasheet.octopart.com:443/RC0402JR-07100KL-Yageo-datasheet-175887523.pdf?src-supplier=Newark; ComponentLink1Description: https://datasheet.octopart.com:443/RC0402JR-07100KL-Yageo-datasheet-175887523.pdf?src-supplier=Newark; ComponentLink2URL: https://datasheet.octopart.com:443/RC0402JR-07100KL-Yageo-datasheet-10408619.pdf?src-supplier=Newark; ComponentLink2Description: https://datasheet.octopart.com:443/RC0402JR-07100KL-Yageo-datasheet-10408619.pdf?src-supplier=Newark; ComponentLink3URL: https://datasheet.octopart.com:443/RC0402JR-07100KL-Yageo-datasheet-8324527.pdf?src-supplier=Newark; ComponentLink3Description: https://datasheet.octopart.com:443/RC0402JR-07100KL-Yageo-datasheet-8324527.pdf?src-supplier=Newark; ComponentLink4URL: https://datasheet.octopart.com:443/RC0402JR-07100KL-Yageo-datasheet-141265859.pdf?src-supplier=Upverter; ComponentLink4Description: https://datasheet.octopart.com:443/RC0402JR-07100KL-Yageo-datasheet-141265859.pdf?src-supplier=Upverter; ComponentLink5URL: https://sigma.octopart.com:443/138820526/technical_drawing/Yageo-RC0402JR-07100KL.pdf?src-supplier=Upverter; ComponentLink5Description: https://sigma.octopart.com:443/138820526/technical_drawing/Yageo-RC0402JR-07100KL.pdf?src-supplier=Upverter; ComponentLink6URL: https://datasheet.octopart.com:443/RC0402JR-07100KL-Yageo-datasheet-98239111.pdf?src-supplier=Upverter; ComponentLink6Description: https://datasheet.octopart.com:443/RC0402JR-07100KL-Yageo-datasheet-98239111.pdf?src-supplier=Upverter; ComponentLink7URL: https://datasheet.octopart.com:443/RC0402JR-07100KL-Yageo-datasheet-141435361.pdf?src-supplier=Upverter; ComponentLink7Description: https://datasheet.octopart.com:443/RC0402JR-07100KL-Yageo-datasheet-141435361.pdf?src-supplier=Upverter; ComponentLink8URL: https://datasheet.octopart.com:443/RC0402JR-07100KL-Yageo-Group-datasheet-190305687.pdf?src-supplier=Future+Electronics; ComponentLink8Description: https://datasheet.octopart.com:443/RC0402JR-07100KL-Yageo-Group-datasheet-190305687.pdf?src-supplier=Future+Electronics; ComponentLink9URL: https://datasheet.octopart.com:443/RC0402JR-07100KL-Yageo-datasheet-164759695.pdf?src-supplier=Future+Electronics; ComponentLink9Description: https://datasheet.octopart.com:443/RC0402JR-07100KL-Yageo-datasheet-164759695.pdf?src-supplier=Future+Electronics; ComponentLink10URL: https://datasheet.octopart.com:443/RC0402JR-07100KL-Yageo-datasheet-137700087.pdf?src-supplier=Future+Electronics; ComponentLink10Description: https://datasheet.octopart.com:443/RC0402JR-07100KL-Yageo-datasheet-137700087.pdf?src-supplier=Future+Electronics; ComponentLink11URL: https://datasheet.octopart.com:443/RC0402JR-07100KL-Yageo-datasheet-12531192.pdf?src-supplier=Future+Electronics; ComponentLink11Description: https://datasheet.octopart.com:443/RC0402JR-07100KL-Yageo-datasheet-12531192.pdf?src-supplier=Future+Electronics; ComponentLink12URL: https://datasheet.octopart.com:443/RC0402JR-07100KL-Yageo-datasheet-505231.pdf?src-supplier=Future+Electronics; ComponentLink12Description: https://datasheet.octopart.com:443/RC0402JR-07100KL-Yageo-datasheet-505231.pdf?src-supplier=Future+Electronics; ComponentLink13URL: https://datasheet.octopart.com:443/RC0402JR-07100KL-Yageo-datasheet-62067350.pdf?src-supplier=element14+APAC; ComponentLink13Description: https://datasheet.octopart.com:443/RC0402JR-07100KL-Yageo-datasheet-62067350.pdf?src-supplier=element14+APAC; ComponentLink14URL: https://datasheet.octopart.com:443/RC0402JR-07100KL-Yageo-Group-datasheet-176638170.pdf?src-supplier=Farnell; ComponentLink14Description: https://datasheet.octopart.com:443/RC0402JR-07100KL-Yageo-Group-datasheet-176638170.pdf?src-supplier=Farnell; ComponentLink15URL: https://datasheet.octopart.com:443/RC0402JR-07100KL-Yageo-datasheet-148775077.pdf?src-supplier=TME; ComponentLink15Description: https://datasheet.octopart.com:443/RC0402JR-07100KL-Yageo-datasheet-148775077.pdf?src-supplier=TME; ComponentLink16URL: https://datasheet.octopart.com/RC0402JR-07100KL-Yageo-datasheet-73766026.pdf; ComponentLink16Description: https://datasheet.octopart.com/RC0402JR-07100KL-Yageo-datasheet-73766026.pdf; ComponentLink17URL: https://datasheet.octopart.com:443/RC0402JR-07100KL-Yageo-datasheet-8329306.pdf?src-supplier=element14; ComponentLink17Description: https://datasheet.octopart.com:443/RC0402JR-07100KL-Yageo-datasheet-8329306.pdf?src-supplier=element14; ComponentLink18URL: http://sigma.octopart.com:80/conflict_mineral_statement/Yageo-company-3.pdf?src-supplier=Compliance+Statements; ComponentLink18Description: http://sigma.octopart.com:80/conflict_mineral_statement/Yageo-company-3.pdf?src-supplier=Compliance+Statements; ComponentLink19URL: http://sigma.octopart.com:80/rohs_statement/Yageo-company-2.pdf?src-supplier=Compliance+Statements; ComponentLink19Description: http://sigma.octopart.com:80/rohs_statement/Yageo-company-2.pdf?src-supplier=Compliance+Statements; LCSC PART: C106234
SW1 = GT-TC089A-H100-L1: -30℃~+85℃ 1.6N 100,000 cycles 10mm 12V 50mA 6mm 6mm Black No Round Button SMD(SMT) Tab SPST Surface Mount,Vertical Without Bracket SMD-4P,6x6mm Tactile Switches ROHS; Manufacturer: G-Switch; LCSC PART: C843652; Manufacturer Part Number: GT-TC089A-H100-L1
SW2 = GT-TC074A-H100-L1: -30℃~+85℃ 1.6N 100,000 cycles 10mm 12V 4.5mm 4.5mm 50mA Black No Round Button SMD(SMT) Tab SPST Surface Mount,Vertical Without Bracket SMD-4P,4.5x4.5mm Tactile Switches ROHS; Manufacturer: G-Switch; LCSC PART: C963232; MFR.Part: GT-TC074A-H100-L1
U1 = AT24C02C-STUM-TQN: SOT-23-5 EEPROM ROHS; Manufacturer: QNH; LCSC PART: C53432858; Manufacturer Part Number: AT24C02C-STUM-TQN
U2 = TPS610994YFFR: 0.7Vin Synchronous Boost Converter with 800 nA Ultra-Low Quiescent Current 6-DSBGA -40 to 85; Manufacturer: Texas Instruments; Manufacturer Lifecycle Status: ACTIVE; Max Duty Cycle: 90%; Max Junction Temperature (Tj): 125°C; Max Supply Voltage: 5.5V; Min Supply Voltage: 700mV; Number of Outputs: 1; Output Voltage: 3.3V; Supplier: Mouser; Supplier Part Number: 595-TPS610994YFFR; Manufacturer Part Number: TPS610994YFFR; RoHS: Compliant; Category: Voltage Regulators - Switching; Stock: 918; Pricing: 1=1.7, 10=1.24, 50=1.13, 100=0.999, 1000=0.88, 10000=0.792 (USD); Height: 625µm; Length: 0m; Lifecycle Status: Production; Max Operating Temperature: 85°C; Min Operating Temperature: -40°C; Pins: 6; Schedule B: 8542390000, 8542390000|8542390000|8542390000|8542390000|8542390000; Thickness: 535µm; Topology: Boost; Width: 0m; ComponentLink1URL: https://sigma.octopart.com:443/102708341/technical_drawing/Texas-Instruments-TPS610994YFFR.pdf?src-supplier=Texas+Instruments; ComponentLink1Description: https://sigma.octopart.com:443/102708341/technical_drawing/Texas-Instruments-TPS610994YFFR.pdf?src-supplier=Texas+Instruments; ComponentLink2URL: https://octopart.com:443/opatz8j6/c1?t=WOiHvKaQ067hiQQk06bPYYslmHf-zaa3unEVrq9qYLczSXfiPFC-h8dOU4ZzEJWJ-3zVqLEiJ1NTVRQ16sGiV55YDbzD3HBkKnSXs-RsLCKyAcUbpQj7xvoyysaqZ7Oc1gKVNqvQ8SoMUzEX8GOGxTP5Y993wEQnOiTvq_853BI-Pbs60xAFN0vAmsIcv9lA6aczl1DkB1H55CnBoDy0Obp3Qs-5Gen7NY_QyS_GtTt-B59J7t-Jb0lEJ-YhjT9CdvlpxQ4dLvniqV2lj0u-vF2n_rYHtxfKm3rNU71zEqcYZAIdQlGa-m51ft3SeFY18n9yUhh33H1WXzCYD56EToUdLA34T5fgFPxH_XlcftoHbzZRZ9CiDyimrKS1GAX1Yc7w0diQ&src-supplier=Texas+Instruments; ComponentLink2Description: https://octopart.com:443/opatz8j6/c1?t=WOiHvKaQ067hiQQk06bPYYslmHf-zaa3unEVrq9qYLczSXfiPFC-h8dOU4ZzEJWJ-3zVqLEiJ1NTVRQ16sGiV55YDbzD3HBkKnSXs-RsLCKyAcUbpQj7xvoyysaqZ7Oc1gKVNqvQ8SoMUzEX8GOGxTP5Y993wEQnOiTvq_853BI-Pbs60xAFN0vAmsIcv9lA6aczl1DkB1H55CnBoDy0Obp3Qs-5Gen7NY_QyS_GtTt-B59J7t-Jb0lEJ-YhjT9CdvlpxQ4dLvniqV2lj0u-vF2n_rYHtxfKm3rNU71zEqcYZAIdQlGa-m51ft3SeFY18n9yUhh33H1WXzCYD56EToUdLA34T5fgFPxH_XlcftoHbzZRZ9CiDyimrKS1GAX1Yc7w0diQ&src-supplier=Texas+Instruments; ComponentLink3URL: https://sigma.octopart.com:443/49261954/technical_drawing/Texas-Instruments-TPS610994YFFR.pdf?src-supplier=Texas+Instruments; ComponentLink3Description: https://sigma.octopart.com:443/49261954/technical_drawing/Texas-Instruments-TPS610994YFFR.pdf?src-supplier=Texas+Instruments; ComponentLink4URL: https://datasheet.octopart.com:443/TPS610994YFFR-Texas-Instruments-datasheet-159752691.pdf?src-supplier=LCSC; ComponentLink4Description: https://datasheet.octopart.com:443/TPS610994YFFR-Texas-Instruments-datasheet-159752691.pdf?src-supplier=LCSC; ComponentLink5URL: https://datasheet.octopart.com:443/TPS610994YFFR-Texas-Instruments-datasheet-94062300.pdf?src-supplier=HQonline; ComponentLink5Description: https://datasheet.octopart.com:443/TPS610994YFFR-Texas-Instruments-datasheet-94062300.pdf?src-supplier=HQonline; ComponentLink6URL: https://datasheet.octopart.com:443/TPS610994YFFR-Texas-Instruments-datasheet-140571912.pdf?src-supplier=Arrow.cn; ComponentLink6Description: https://datasheet.octopart.com:443/TPS610994YFFR-Texas-Instruments-datasheet-140571912.pdf?src-supplier=Arrow.cn; ComponentLink7URL: http://sigma.octopart.com:80/reach_statement/Texas-Instruments-company-64.pdf?src-supplier=Compliance+Statements; ComponentLink7Description: http://sigma.octopart.com:80/reach_statement/Texas-Instruments-company-64.pdf?src-supplier=Compliance+Statements; ComponentLink8URL: http://sigma.octopart.com:80/conflict_mineral_statement/Texas-Instruments-company-63.pdf?src-supplier=Compliance+Statements; ComponentLink8Description: http://sigma.octopart.com:80/conflict_mineral_statement/Texas-Instruments-company-63.pdf?src-supplier=Compliance+Statements; LCSC PART: C2650335
U3 = STM32G030F6P6: Microcontroller 32-bit ARM Cortex-M0+ RISC 32KB Flash 3.3V 20-Pin TSSOP Tray; Manufacturer: STMicroelectronics; ADC Channels (Resolution): 16-Ch 12-Bit; Data Bus Width: 32b; EEPROM Memory Size: 0B; Frequency: 64MHz; Interface: I2S; Max Junction Temperature (Tj): 105°C; Max Supply Current: 8.3mA; Max Supply Voltage: 3.6V; Min Supply Voltage: 2V; Nominal Supply Voltage (DC): 3V; Number of A/D Converters: 1; Number of ADC Channels: 16; Number of I2C Channels: 2; Number of PWM Channels: 11; Number of Timers/Counters: 6; Peripherals: POR, RTC; RAM Size: 8kB; Supplier: DigiKey; Supplier Part Number: 497-STM32G030F6P6-ND; Manufacturer Part Number: STM32G030F6P6; RoHS: Compliant; Category: Microcontrollers; Stock: 75079; Pricing: 1=2.18, 10=1.604, 74=1.32919, 148=1.26466, 518=1.10917 (USD); Ambient Temperature Range High: 85°C; Case/Package: TSSOP; China RoHS: Compliant; Core Architecture: ARM Cortex-M0+; Country of Origin: Mainland China, Philippines, Taiwan; Export Control Classification Number (ECCN) Code: 3A991.A.2; Flash Memory Size: 32kB; Height: 1.2mm; Height - Seated (Max): 1.2mm; Harmonized Tariff Schedule (HTS) Code: 8542.31.00.25; Introduction Date: 2019-08-13; Length: 6.5mm; Lifecycle Status: Production; Clock Frequency: 64MHz; Max Operating Temperature: 85°C; Memory Size: 32kB; Memory Format: FLASH; Min Operating Temperature: -40°C; Number of Channels: 16; Number of I/Os: 2; Number of SPI Channels: 2; Number of Terminals: 20; Number of UART Channels: 2; Number of USART Channels: 2; REACH SVHC: Unaffected; Schedule B: 8542310000, 8542310000|8542310000|8542310000|8542310000|8542310000; Terminal Pitch: 650µm; Width: 4.4mm; ComponentLink1URL: https://datasheet.octopart.com:443/STM32G030F6P6-STMicroelectronics-datasheet-137692524.pdf?src-supplier=TME; ComponentLink1Description: https://datasheet.octopart.com:443/STM32G030F6P6-STMicroelectronics-datasheet-137692524.pdf?src-supplier=TME; LCSC PART: C724040
U4 = HT1621B-JSM: -25℃~+75℃ 0.1uA 1/3,1/2 1/4,1/3,1/2 2.4V~5.2V 256kHz 3-Wire Serial Interface 32 Segment 32x4 bit 60uA Built-in oscillator SSOP-48 LCD Drivers ROHS; Manufacturer: JSMSEMI; LCSC PART: C18190086; Manufacturer Part Number: HT1621B-JSM
Y1 = X321532768KGD2SI: -40℃~+85℃ 12.5pF 32.768kHz 70kΩ SMD crystal oscillator ±20ppm ±30ppm SMD3215-2P Crystals ROHS; Manufacturer: YXC Crystal Oscillators; LCSC PART: C620155; Manufacturer Part Number: X321532768KGD2SI